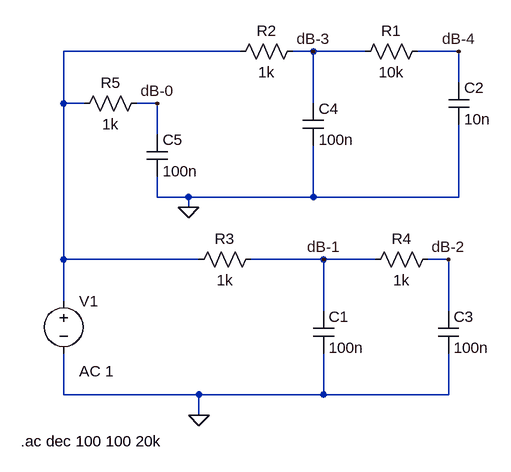
[diagram p0: schematic cascade_rc_ltspice.asc]
cascade_rc_ltspice.asc, the LTspice schematic file:
Version 4
SHEET 1 880 776
WIRE 32 64 -240 64
WIRE 144 64 112 64
WIRE 224 64 144 64
WIRE 368 64 304 64
WIRE 368 112 368 64
WIRE -240 144 -240 64
WIRE -208 144 -240 144
WIRE -96 144 -128 144
WIRE 144 144 144 64
WIRE -96 192 -96 144
WIRE -96 288 -96 256
WIRE -48 288 -96 288
WIRE 144 288 144 208
WIRE 144 288 -48 288
WIRE 368 288 368 176
WIRE 368 288 144 288
WIRE -48 304 -48 288
WIRE -240 384 -240 144
WIRE -32 384 -240 384
WIRE 160 384 48 384
WIRE 240 384 160 384
WIRE 352 384 320 384
WIRE -240 448 -240 384
WIRE 160 464 160 384
WIRE 352 464 352 384
WIRE -240 592 -240 528
WIRE -32 592 -240 592
WIRE 160 592 160 528
WIRE 160 592 -32 592
WIRE 352 592 352 528
WIRE 352 592 160 592
WIRE -32 624 -32 592
FLAG -32 624 0
FLAG 160 384 dB-1
FLAG 352 384 dB-2
FLAG 368 64 dB-4
FLAG -48 304 0
FLAG 144 64 dB-3
FLAG -96 144 dB-0
SYMBOL res 320 48 R90
WINDOW 0 0 56 VBottom 2
WINDOW 3 32 56 VTop 2
SYMATTR InstName R1
SYMATTR Value 10k
SYMBOL res 128 48 R90
WINDOW 0 0 56 VBottom 2
WINDOW 3 32 56 VTop 2
SYMATTR InstName R2
SYMATTR Value 1k
SYMBOL res 64 368 R90
WINDOW 0 0 56 VBottom 2
WINDOW 3 32 56 VTop 2
SYMATTR InstName R3
SYMATTR Value 1k
SYMBOL res 336 368 R90
WINDOW 0 0 56 VBottom 2
WINDOW 3 32 56 VTop 2
SYMATTR InstName R4
SYMATTR Value 1k
SYMBOL res -112 128 R90
WINDOW 0 0 56 VBottom 2
WINDOW 3 32 56 VTop 2
SYMATTR InstName R5
SYMATTR Value 1k
SYMBOL cap 352 112 R0
SYMATTR InstName C2
SYMATTR Value 10n
SYMBOL cap 128 144 R0
SYMATTR InstName C4
SYMATTR Value 100n
SYMBOL cap -112 192 R0
SYMATTR InstName C5
SYMATTR Value 100n
SYMBOL cap 144 464 R0
SYMATTR InstName C1
SYMATTR Value 100n
SYMBOL cap 336 464 R0
SYMATTR InstName C3
SYMATTR Value 100n
SYMBOL voltage -240 432 R0
WINDOW 123 24 124 Left 2
WINDOW 39 0 0 Left 0
SYMATTR InstName V1
SYMATTR Value ""
SYMATTR Value2 AC 1
TEXT -306 664 Left 2 !.ac dec 100 100 20k

The netlist it stands for:
* cascade_rc_ltspice.asc
R1 dB-4 dB-3 10k
R2 dB-3 N001 1k
R3 dB-1 N001 1k
R4 dB-2 dB-1 1k
R5 dB-0 N001 1k
C2 dB-4 0 10n
C4 dB-3 0 100n
C5 dB-0 0 100n
C1 dB-1 0 100n
C3 dB-2 0 100n
V1 N001 0 AC 1
.ac dec 100 100 20k
.backanno
.end